# EAGLE design Version2 (EAGLE 7.1.0)
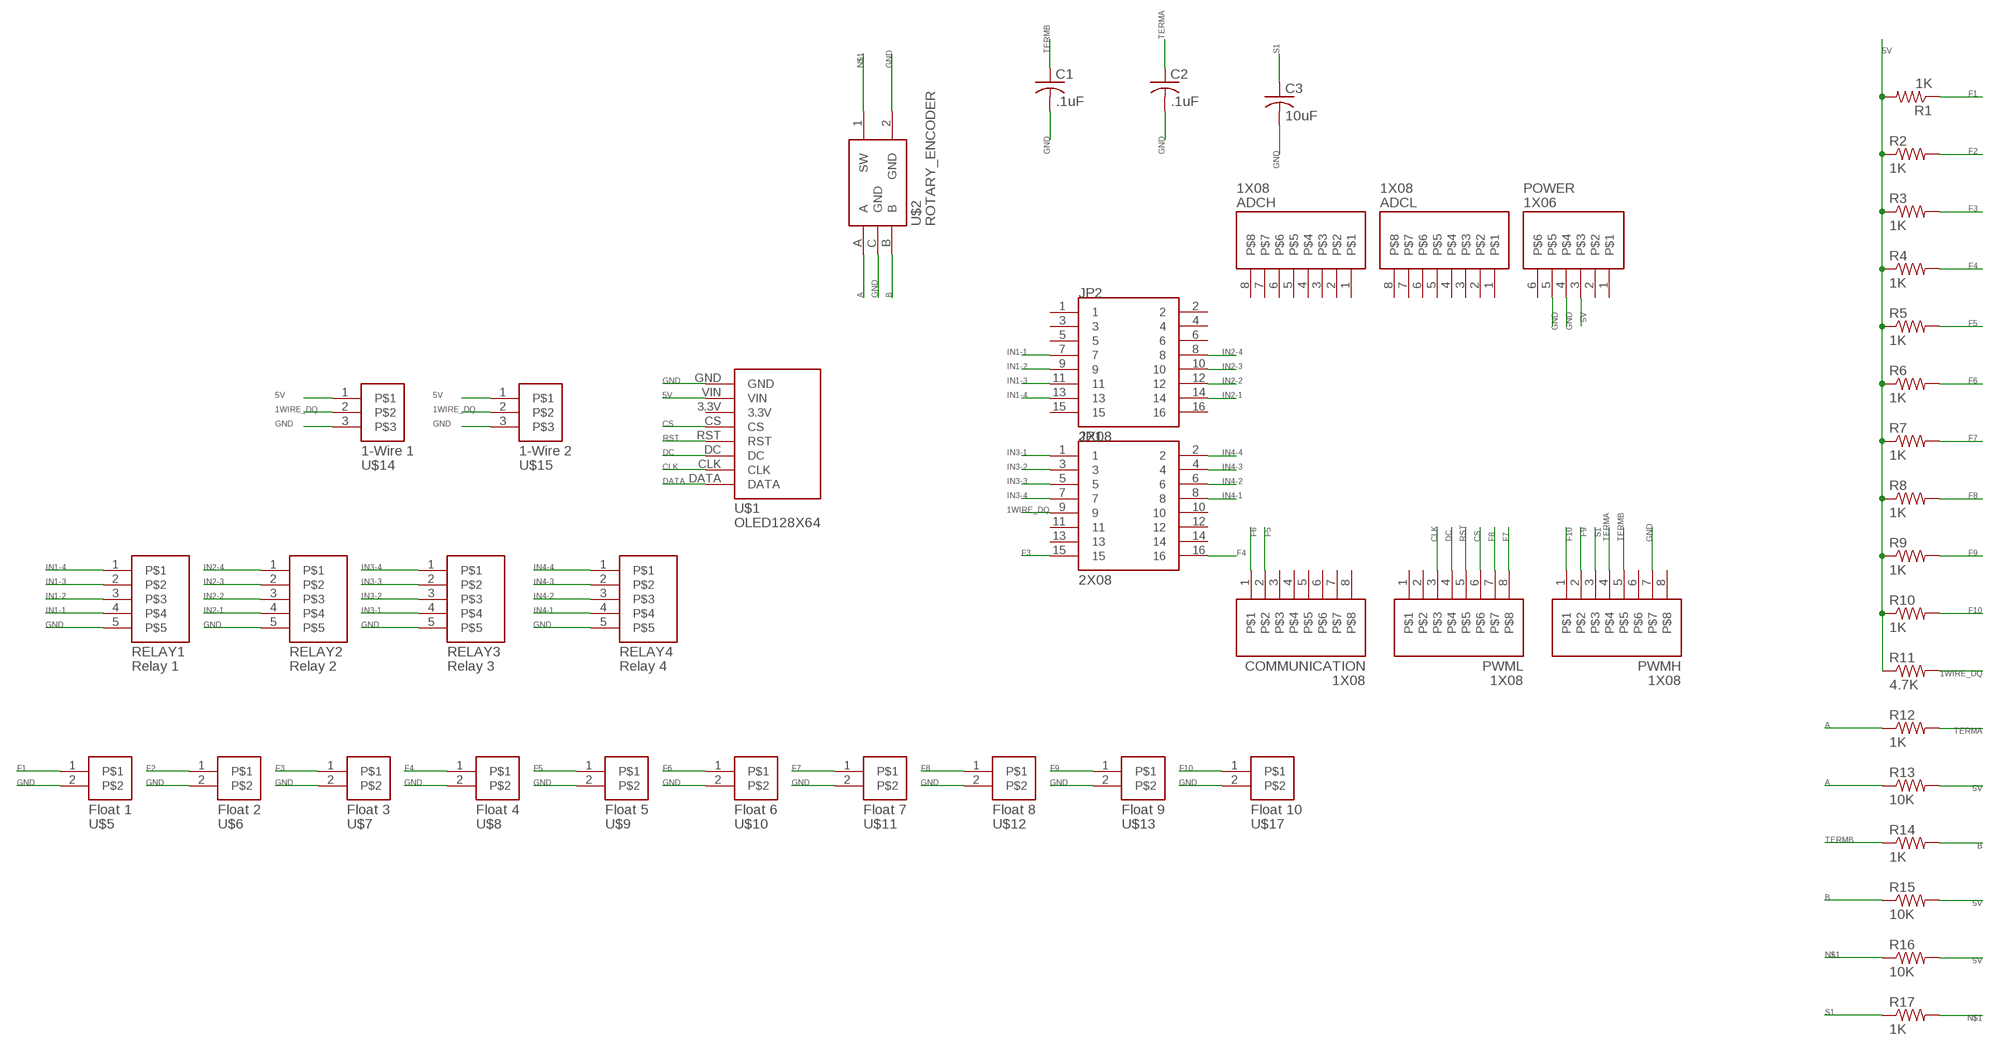
[diagram p0: schematic, sheet 1]

## Parts
ADCH  1X08  [1X08_SMT]
ADCL  1X08  [1X08_SMT]
C1  .1uF  C-USC0805K  [C0805K]
C2  .1uF  C-USC0805K  [C0805K]
C3  10uF  C-USC0805K  [C0805K]
COMMUNICATION  1X08  [1X08_SMT]
JP1  2X08  [2X08_SMT]
JP2  2X08  [2X08_SMT]
POWER  1X06  [1X06_SMT]
PWMH  1X08  [1X08_SMT]
PWML  1X08  [1X08_SMT]
R1  1K  R-US_R0805  [R0805]
R2  1K  R-US_R0805  [R0805]
R3  1K  R-US_R0805  [R0805]
R4  1K  R-US_R0805  [R0805]
R5  1K  R-US_R0805  [R0805]
R6  1K  R-US_R0805  [R0805]
R7  1K  R-US_R0805  [R0805]
R8  1K  R-US_R0805  [R0805]
R9  1K  R-US_R0805  [R0805]
R10  1K  R-US_R0805  [R0805]
R11  4.7K  R-US_R0805  [R0805]
R12  1K  R-US_R0805  [R0805]
R13  10K  R-US_R0805  [R0805]
R14  1K  R-US_R0805  [R0805]
R15  10K  R-US_R0805  [R0805]
R16  10K  R-US_R0805  [R0805]
R17  1K  R-US_R0805  [R0805]
RELAY1  Relay 1  5PIN  [5PIN-MOLEX-HEADER-W-PEGS]
RELAY2  Relay 2  5PIN  [5PIN-MOLEX-HEADER-W-PEGS]
RELAY3  Relay 3  5PIN  [5PIN-MOLEX-HEADER-W-PEGS]
RELAY4  Relay 4  5PIN  [5PIN-MOLEX-HEADER-W-PEGS]
U$1  OLED128X64  [OLED128X64]
U$2  ROTARY_ENCODER  PEC11-4215F-S24  [PEC11-4215F-S24]
U$5  Float 1  2PIN  [2PIN-MOLEX-HEADER-W-PEGS]
U$6  Float 2  2PIN  [2PIN-MOLEX-HEADER-W-PEGS]
U$7  Float 3  2PIN  [2PIN-MOLEX-HEADER-W-PEGS]
U$8  Float 4  2PIN  [2PIN-MOLEX-HEADER-W-PEGS]
U$9  Float 5  2PIN  [2PIN-MOLEX-HEADER-W-PEGS]
U$10  Float 6  2PIN  [2PIN-MOLEX-HEADER-W-PEGS]
U$11  Float 7  2PIN  [2PIN-MOLEX-HEADER-W-PEGS]
U$12  Float 8  2PIN  [2PIN-MOLEX-HEADER-W-PEGS]
U$13  Float 9  2PIN  [2PIN-MOLEX-HEADER-W-PEGS]
U$14  1-Wire 1  3PIN  [3PIN-MOLEX-HEADER-W-PEGS]
U$15  1-Wire 2  3PIN  [3PIN-MOLEX-HEADER-W-PEGS]
U$17  Float 10  2PIN  [2PIN-MOLEX-HEADER-W-PEGS]

## Nets
1WIRE_DQ: JP1.9 R11.2 U$14.2 U$15.2
5V: POWER.3 R1.2 R2.1 R3.1 R4.1 R5.1 R6.1 R7.1 R8.1 R9.1 R10.1 R11.1 R13.2 R15.2 R16.2 U$1.VIN U$14.1 U$15.1
A: R12.1 R13.1 U$2.A
B: R14.2 R15.1 U$2.B
CLK: PWML.3 U$1.CLK
CS: PWML.6 U$1.CS
DATA: U$1.DATA
DC: PWML.4 U$1.DC
F1: R1.1 U$5.1
F2: R2.2 U$6.1
F3: JP1.15 R3.2 U$7.1
F4: JP1.16 R4.2 U$8.1
F5: COMMUNICATION.2 R5.2 U$9.1
F6: COMMUNICATION.1 R6.2 U$10.1
F7: PWML.8 R7.2 U$11.1
F8: PWML.7 R8.2 U$12.1
F9: PWMH.2 R9.2 U$13.1
F10: PWMH.1 R10.2 U$17.1
GND [gnd]: C1.2 C2.2 C3.2 POWER.4 POWER.5 PWMH.7 RELAY1.5 RELAY2.5 RELAY3.5 RELAY4.5 U$1.GND U$2.2(GND) U$2.C(GND) U$5.2 U$6.2 U$7.2 U$8.2 U$9.2 U$10.2 U$11.2 U$12.2 U$13.2 U$14.3 U$15.3 U$17.2
IN1-1: JP2.7 RELAY1.4
IN1-2: JP2.9 RELAY1.3
IN1-3: JP2.11 RELAY1.2
IN1-4: JP2.13 RELAY1.1
IN2-1: JP2.14 RELAY2.4
IN2-2: JP2.12 RELAY2.3
IN2-3: JP2.10 RELAY2.2
IN2-4: JP2.8 RELAY2.1
IN3-1: JP1.1 RELAY3.4
IN3-2: JP1.3 RELAY3.3
IN3-3: JP1.5 RELAY3.2
IN3-4: JP1.7 RELAY3.1
IN4-1: JP1.8 RELAY4.4
IN4-2: JP1.6 RELAY4.3
IN4-3: JP1.4 RELAY4.2
IN4-4: JP1.2 RELAY4.1
N$1: R16.1 R17.2 U$2.1(SW)
RST: PWML.5 U$1.RST
S1: C3.1 PWMH.3 R17.1
TERMA: C2.1 PWMH.4 R12.2
TERMB: C1.1 PWMH.5 R14.1
Unconnected: ADCH.1 ADCH.2 ADCH.3 ADCH.4 ADCH.5 ADCH.6 ADCH.7 ADCH.8 ADCL.1 ADCL.2 ADCL.3 ADCL.4 ADCL.5 ADCL.6 ADCL.7 ADCL.8 COMMUNICATION.3 COMMUNICATION.4 COMMUNICATION.5 COMMUNICATION.6 COMMUNICATION.7 COMMUNICATION.8 JP1.10 JP1.11 JP1.12 JP1.13 JP1.14 JP2.1 JP2.2 JP2.3 JP2.4 JP2.5 JP2.6 JP2.15 JP2.16 POWER.1 POWER.2 POWER.6 PWMH.6 PWMH.8 PWML.1 PWML.2 U$1.3.3V

## Library data of the parts
ADCH ADCL COMMUNICATION PWMH PWML = pinhead:1X08
C1 = rcl:C-US: CAPACITOR, American symbol
C2 C3 = resistor:C-US: CAPACITOR, American symbol
JP1 JP2 = pinhead:2X08
POWER = pinhead:1X06
R1-R17 = rcl:R-US_: RESISTOR, American symbol
RELAY1-RELAY4 = Saleem_lib:5PIN
U$1 = Saleem_lib:OLED128X64
U$2 = Saleem_lib:PEC11-4215F-S24
U$5-U$13 U$17 = Saleem_lib:2PIN
U$14 U$15 = Saleem_lib:3PIN

## Net classes
0 default: width 0.203 mm, drill 0.406 mm, clearance 0.203 mm
2 gnd: width 0.305 mm, drill 0.711 mm, clearance 0.203 mm

## Board
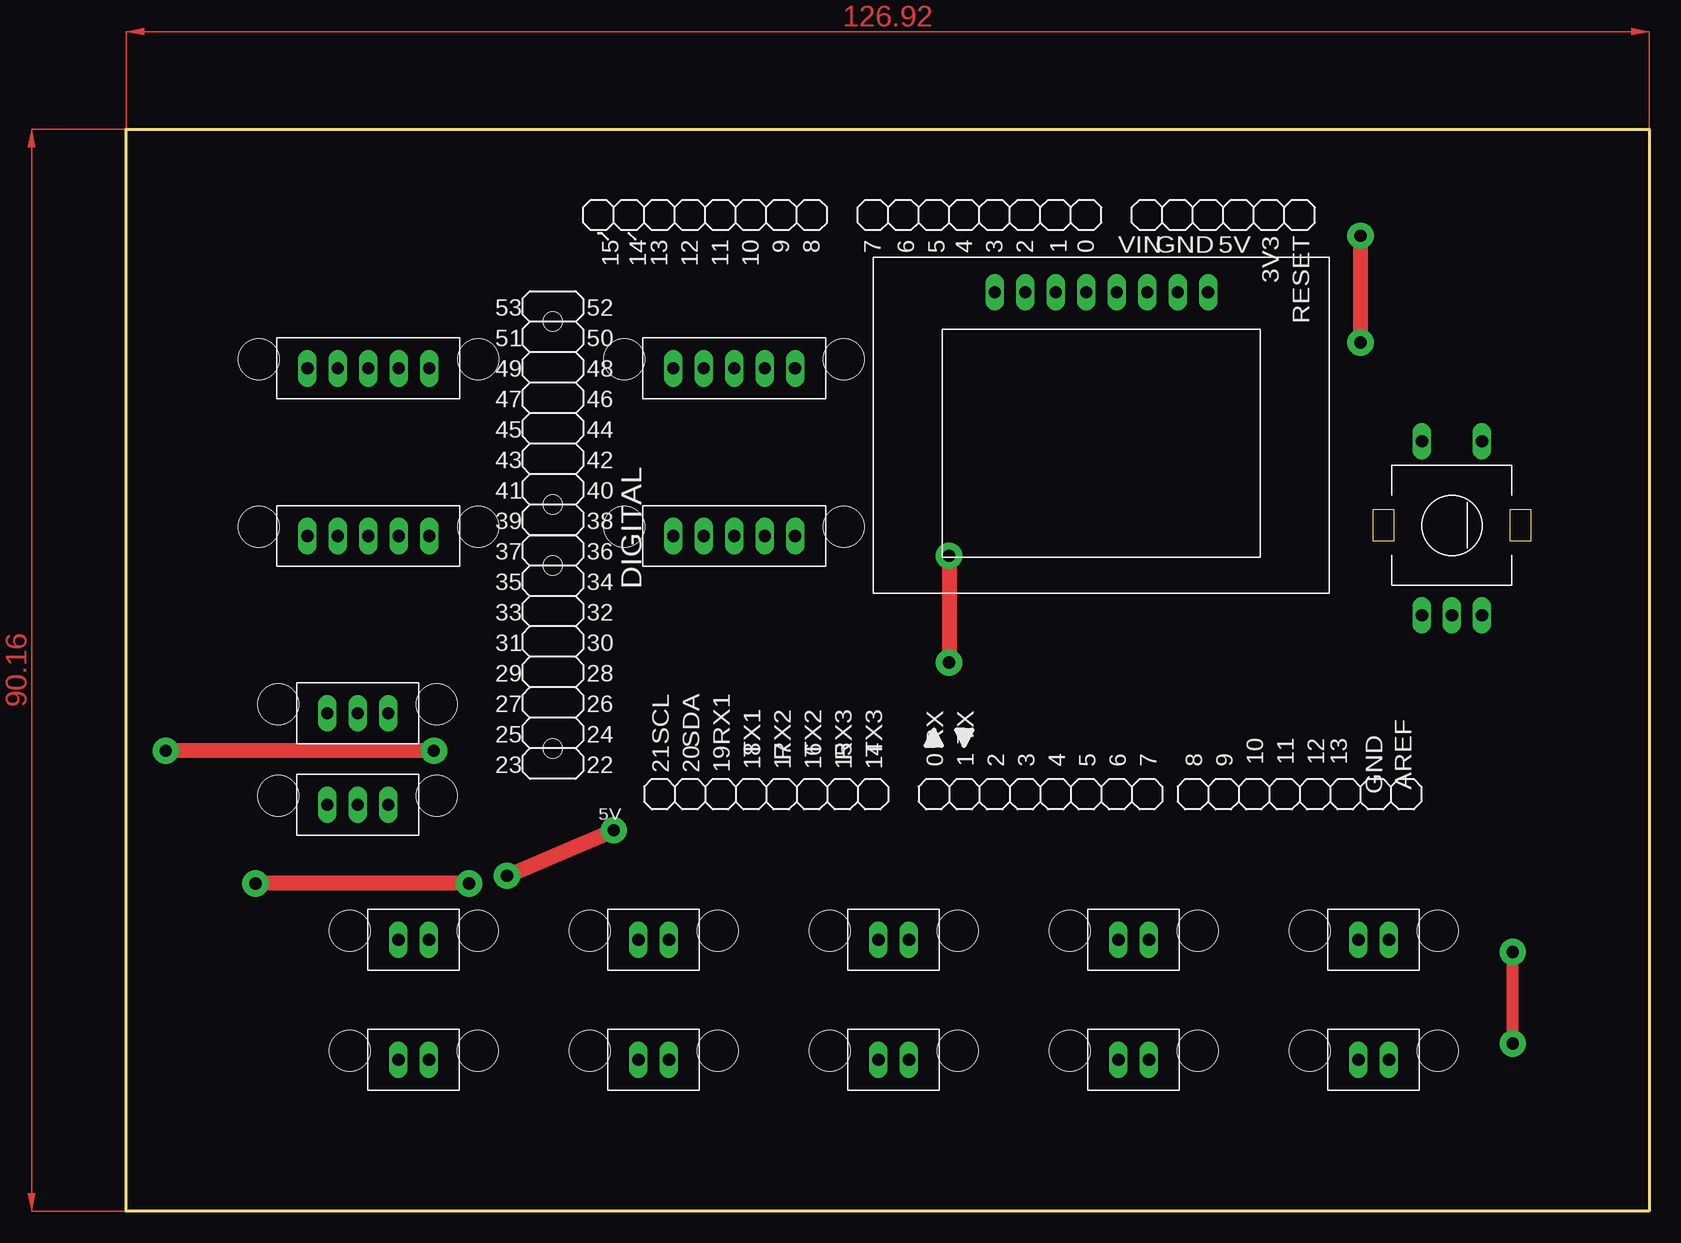
[diagram p1: board, top side]
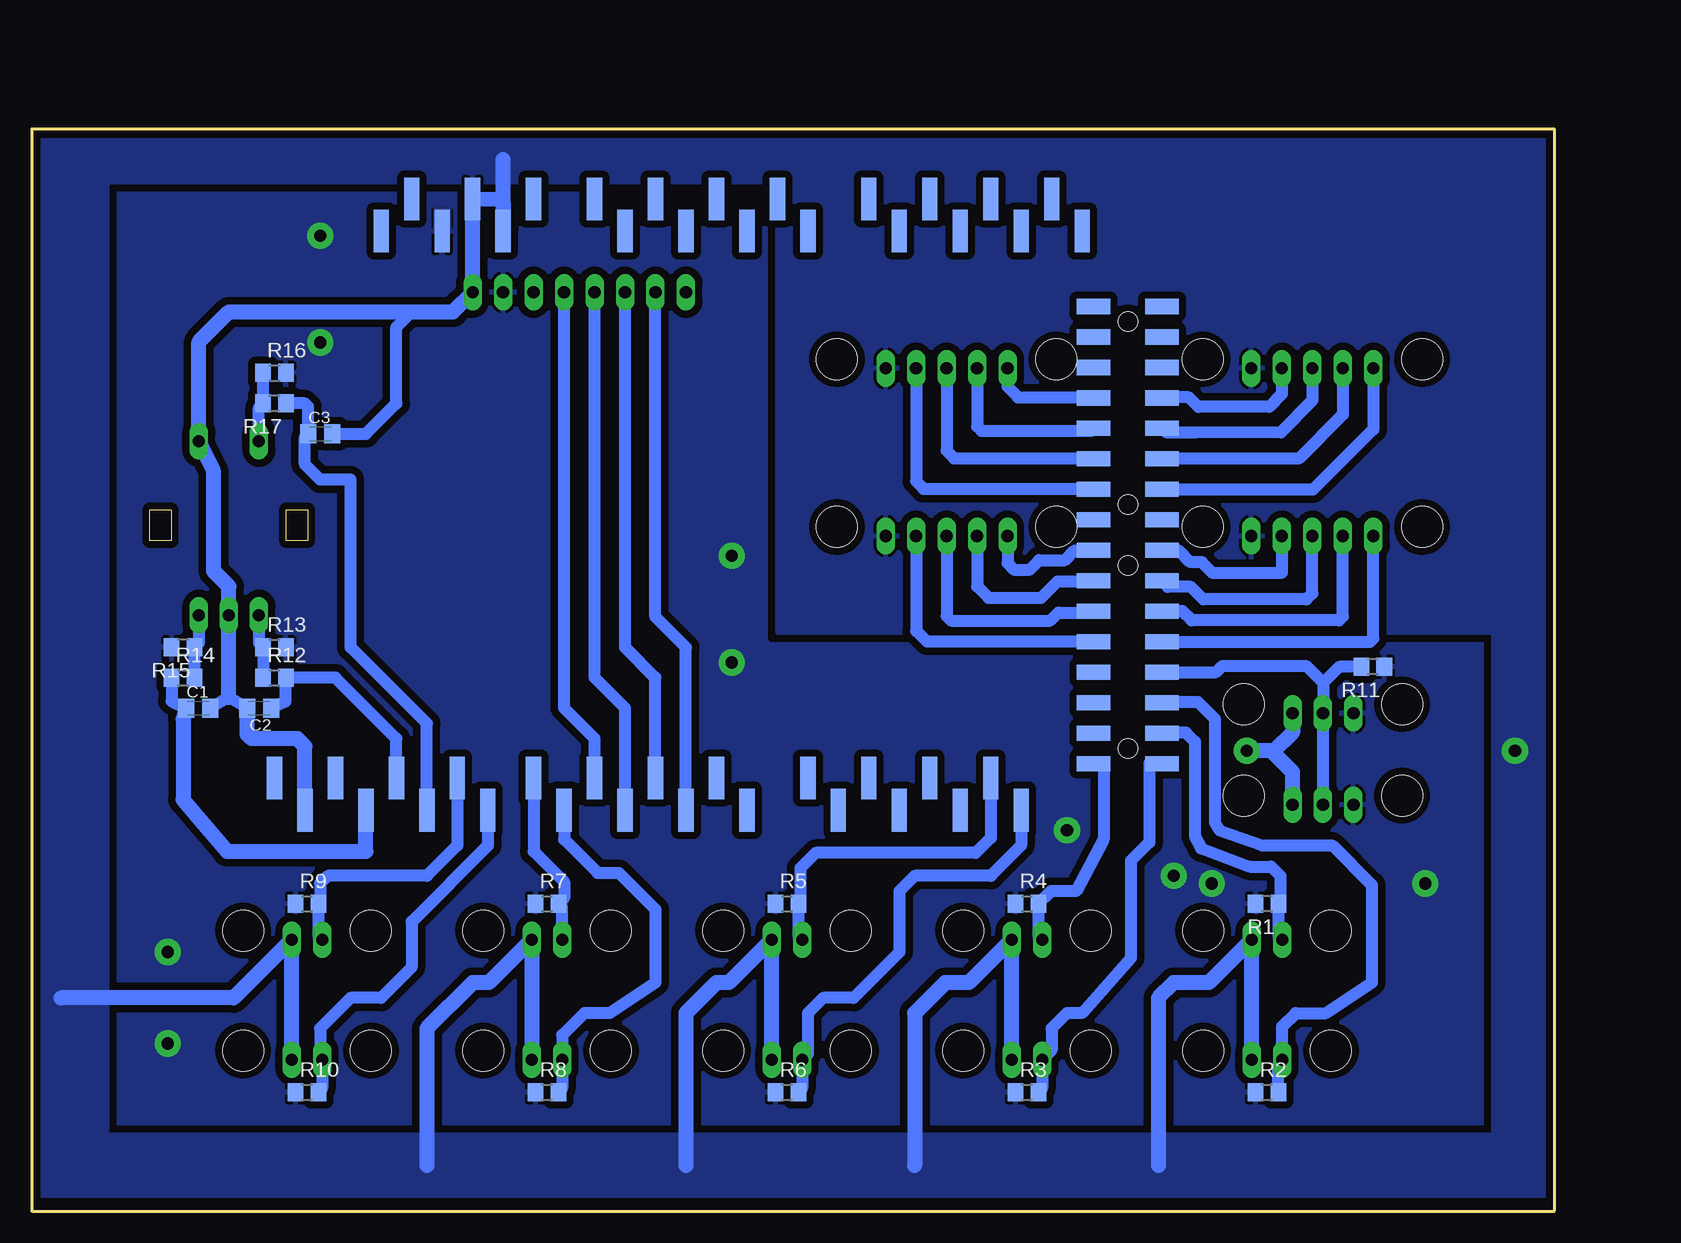
[diagram p2: board, bottom side, seen from below]

Size 126.92 x 90.16 mm. Coordinates in mm from the lower left corner, seen from the top.
Outline: 0,90.16 126.92,90.16 126.92,0 0,0 0,90.16
Copper layers (1*16): Top 0.0356mm / dielectric 1.5011mm / Bottom 0.0356mm
Design rules "default": minimum track width 6mil, minimum drill 13mil, track to track 6mil, track to pad 6mil, pad to pad 6mil, via to via 6mil, smd to smd 6mil, copper to edge 15mil, drill to drill 6mil, minimum pad ring 7mil, minimum via ring 7mil, stop-mask expansion 0mil, vias tented up to drill 24mil, thermal gap 10mil

### Footprints (pad centres in the part's own frame; a part is rotated, then mirrored left to right if it is on the bottom)
1X08_SMT = smd 1.27 x 3.56 bottom: 1 -8.89,-1.335; 2 -6.35,1.335; 3 -3.81,-1.335; 4 -1.27,1.335; 5 1.27,-1.335; 6 3.81,1.335; 7 6.35,-1.335; 8 8.89,1.335
C0805K = smd 1.3 x 1.6: 1 -1,0; 2 1,0
2X08_SMT = smd 1.27 x 2.79 bottom: 1 -7.62,-2.855; 2 -7.62,2.855; 3 -5.08,-2.855; 4 -5.08,2.855; 5 -2.54,-2.855; 6 -2.54,2.855; 7 0,-2.855; 8 0,2.855; 9 2.54,-2.855; 10 2.54,2.855; 11 5.08,-2.855; 12 5.08,2.855; 13 7.62,-2.855; 14 7.62,2.855; 15 10.16,-2.855; 16 10.16,2.855 | hole 1.6: -6.35,0; 8.89,0
1X06_SMT = smd 1.27 x 3.56 bottom: 1 -6.35,1.335; 2 -3.81,-1.335; 3 -1.27,1.335; 4 1.27,-1.335; 5 3.81,1.335; 6 6.35,-1.335
R0805 = smd 1.3 x 1.5: 1 -0.95,0; 2 0.95,0
5PIN-MOLEX-HEADER-W-PEGS = drill 1.016 long: 1 -5.08,0; 2 -2.54,0; 3 0,0; 4 2.54,0; 5 5.08,0 | hole 3.4: -9.14,0.76; 9.14,0.76
OLED128X64 = drill 1.016 long: 3.3V 3.81,11.08; CLK -6.35,11.08; CS 1.27,11.08; DATA -8.89,11.08; DC -3.81,11.08; GND 8.89,11.08; RST -1.27,11.08; VIN 6.35,11.08
PEC11-4215F-S24 = drill 1.016 long: 1 -2.5,7; 2 2.5,7; A -2.5,-7.5; B 2.5,-7.5; C 0,-7.5
2PIN-MOLEX-HEADER-W-PEGS = drill 1.016 long: 1 -1.27,0; 2 1.27,0 | hole 3.4: -5.33,0.76; 5.33,0.76
3PIN-MOLEX-HEADER-W-PEGS = drill 1.016 long: 1 -2.54,0; 2 0,0; 3 2.54,0 | hole 3.4: -6.6,0.76; 6.6,0.76

### Placement (x,y rotation side)
ADCH  48.26,83.01 180 top
ADCL  71.12,83.01 180 top
C1  113.03,41.91 0 bottom
C2  107.95,41.91 180 bottom
C3  102.87,64.77 0 bottom
COMMUNICATION  53.34,34.75 0 top
JP1  35.56,47.45 270 top
JP2  35.56,67.77 270 top
POWER  91.44,83.01 180 top
PWMH  97.79,34.75 0 top
PWML  76.2,34.75 0 top
R1  23.97,25.62 180 bottom
R2  23.97,9.91 0 bottom
R3  43.97,9.91 0 bottom
R4  43.97,25.62 0 bottom
R5  63.97,25.62 0 bottom
R6  63.97,9.91 0 bottom
R7  83.97,25.62 0 bottom
R8  83.97,9.91 0 bottom
R9  103.97,25.62 0 bottom
R10  103.97,9.91 0 bottom
R11  15.15,45.36 180 bottom
R12  106.68,44.45 0 bottom
R13  106.68,46.99 0 bottom
R14  114.3,44.45 0 bottom
R15  114.3,46.99 180 bottom
R16  106.68,69.85 0 bottom
R17  106.68,67.31 180 bottom
RELAY1  20.19,70.23 0 top
RELAY2  50.67,70.23 0 top
RELAY3  20.19,56.26 0 top
RELAY4  50.67,56.26 0 top
U$1  81.28,65.48 0 top
U$2  110.49,57.15 0 top
U$5  23.97,22.62 0 top
U$6  23.97,12.62 0 top
U$7  43.97,12.62 0 top
U$8  43.97,22.62 0 top
U$9  63.97,22.62 0 top
U$10  63.97,12.62 0 top
U$11  83.97,22.62 0 top
U$12  83.97,12.62 0 top
U$13  103.97,22.62 0 top
U$14  19.3,41.48 0 top
U$15  19.3,33.86 0 top
U$17  103.97,12.62 0 top

### Tracks (layer width: path | path; a pad name or v marks a point on that pad's centre or on a via)
1WIRE_DQ
  Bottom 1.016: 19.24,41.55 U$14.2 | U$14.2 U$15.2 | JP1.9 28.2,44.91 27.68,45.43 20.71,45.43 19.29,44.02 | 19.29,44.02 19.29,41.49 U$14.2 | R11.2 17.96,45.36 19.29,44.02
5V  (via drill 1.02 pad 2.18)
  Top 1.016: v115.57,13.97 v115.57,21.59
  Top 1.27: v28.58,27.3 v10.8,27.3 | v68.58,54.61 v68.58,45.72 | v31.75,27.94 v40.64,31.75 | v102.87,81.28 v102.87,72.39
  pour Bottom (isolate 0.61, rank 2): -1.27,91.44 127.64,91.44 127.64,-0.64 -1.27,-0.64
  pour Bottom (no thermals): 92.08,83.82 92.08,81.92 93.34,81.92 93.34,83.82
A
  Bottom 1.016: U$2.A 107.99,47.35 R13.1 R12.1
B
  Bottom 1.016: U$2.B 112.99,47.35 R15.1 R14.2
CLK
  Bottom 1.016: PWML.3 72.39,46.99 74.93,49.53 U$1.CLK
CS
  Bottom 1.016: PWML.6 80.01,39.37 82.55,41.91 U$1.CS
DC
  Bottom 1.016: PWML.4 74.93,44.45 77.47,46.99 U$1.DC
F1
  Bottom 1.016: U$5.1 23.02,22.94 R1.1 22.86,25.78 22.86,27.94 23.62,28.7 25.4,28.7 29.46,30.23 29.97,31.24 29.97,39.12 30.73,39.88 32.77,39.88
F2
  Bottom 1.016: 28.32,41.02 28.32,32.38 27.94,31.75 24.38,30.48 18.54,30.48 15.24,27.18 15.24,19.05 19.05,16.51 21.59,16.51 22.7,15.4 U$6.1 23.02,12.3 R2.2
F3
  Bottom 1.016: JP1.15 32.75,37.34 33.78,37.34 33.78,30.73 35.31,29.21 35.31,21.08 39.37,16.51 40.64,16.51 41.91,15.24 41.91,13.41 U$7.1 42.7,10.22 R3.2
F4
  Bottom 1.016: JP1.16 38.37,37.34 37.85,37.34 37.59,37.08 37.59,30.99 39.88,26.67 41.97,26.67 R4.2 43.02,22.94 U$8.1
F5
  Bottom 1.016: COMMUNICATION.2 46.99,31.12 48.26,29.85 61.59,29.85 62.87,28.57 62.87,25.78 R5.2 63.02,22.94 U$9.1
F6
  Bottom 1.016: COMMUNICATION.1 44.45,30.48 46.99,27.94 53.34,27.94 54.61,26.67 54.61,21.59 58.42,17.78 60.96,17.78 62.23,16.51 62.23,13.09 U$10.1 62.7,10.22 R6.2
F7
  Bottom 1.016: PWML.8 85.09,29.97 82.55,27.43 82.55,26.09 R7.2 82.7,25.3 U$11.1
F8
  Bottom 1.016: PWML.7 82.55,30.99 79.76,28.19 77.98,28.19 74.93,25.15 74.93,19.05 78.74,16.51 80.86,16.51 82.7,14.67 U$12.1 82.7,10.22 R8.2
F9
  Bottom 1.016: PWMH.2 91.44,30.48 93.98,27.94 102.23,27.94 102.87,27.3 102.87,25.77 R9.2 103.02,22.94 U$13.1
F10
  Bottom 1.016: PWMH.1 88.9,30.48 95.25,24.13 95.25,20.32 97.79,17.78 100.33,17.78 102.87,15.24 102.87,12.79 U$17.1 102.7,10.22 R10.2
GND  (via drill 1.02 pad 2.18)
  Top 1.27: 25.4,38.61 v25.65,38.35 v3.3,38.35
  Bottom 1.016: C2.2 110.49,42.81 C1.2 | C3.2 99.06,64.77 96.52,67.31 96.52,73.66 95.25,74.93
  Bottom 1.27: 124.46,17.78 110.08,17.78 U$13.2 U$17.2 | U$12.2 U$11.2 88.81,19.05 90.17,19.05 93.98,15.24 93.98,3.81 | 72.39,3.81 72.39,16.51 69.85,19.05 68.81,19.05 U$9.2 U$10.2 | 53.34,3.81 53.34,16.51 50.8,19.05 48.81,19.05 U$8.2 U$7.2 | 33.02,3.81 33.02,17.78 31.75,19.05 28.81,19.05 U$5.2 U$6.2 | PWMH.7 104.14,38.73 104.78,39.37 108.58,39.37 108.95,39.73 C2.2 | 110.49,42.81 U$2.C 110.49,52.07 111.76,53.34 111.76,61.65 U$2.2 112.99,72.43 110.49,74.93 95.25,74.93 91.8,74.93 U$1.GND POWER.4 87.88,84.33 87.63,84.07 POWER.5 87.63,87.63 | U$15.3 21.84,36.58 23.62,38.35 v25.65,38.35 23.37,38.35 21.84,39.88 U$14.3
  pour Bottom (isolate 0.61): 5.08,85.73 120.65,85.73 120.65,6.35 5.08,6.35 5.08,85.09 0.63,85.09 0.63,1.27 127,1.27 127,89.54 4.45,89.54
  pour Bottom (isolate 0.61): 0.63,90.17 64.77,90.17 64.77,48.26 0.63,48.26
IN1-1
  Bottom 1.016: RELAY1.4 22.73,68.1 23.8,67.03 29.69,67.03 30.48,67.82 32.66,67.82 JP2.7
IN1-2
  Bottom 1.016: RELAY1.3 20.19,67.59 22.81,64.9 29.92,64.87 32.35,64.87 JP2.9
IN1-3
  Bottom 1.016: RELAY1.2 17.65,66.4 21.34,62.71 32.68,62.71 JP2.11
IN1-4
  Bottom 1.016: RELAY1.1 15.11,65.15 20.14,60.12 32.68,60.12 JP2.13
IN2-1
  Bottom 1.016: RELAY2.4 53.21,60.83 52.58,60.2 38.46,60.2 JP2.14
IN2-2
  Bottom 1.016: RELAY2.3 50.67,63.37 50.04,62.74 38.46,62.74 JP2.12
IN2-3
  Bottom 1.016: RELAY2.2 48.13,65.41 47.75,65.02 38.62,65.02 JP2.10
IN2-4
  Bottom 1.016: RELAY2.1 45.59,68.71 44.7,67.82 38.46,67.82 JP2.8
IN3-1
  Bottom 1.016: RELAY3.4 22.73,53.24 22.81,53.16 28.47,53.16 29.39,54.08 30.35,54.08 31.34,55.07 JP1.1
IN3-2
  Bottom 1.016: JP1.3 32.7,52.46 32.25,52.01 30.32,52.01 29.28,50.98 20.69,50.98 20.19,51.47 RELAY3.3
IN3-3
  Bottom 1.016: JP1.5 32.69,50.01 31.03,50.01 30.25,49.23 17.98,49.23 17.65,49.56 RELAY3.2
IN3-4
  Bottom 1.016: JP1.7 32.68,47.42 15.39,47.42 15.11,47.7 RELAY3.1
IN4-1
  Bottom 1.016: RELAY4.4 53.21,48.36 52.32,47.47 38.44,47.47 JP1.8
IN4-2
  Bottom 1.016: RELAY4.3 50.67,49.58 50.29,49.2 42.04,49.2 41.35,49.89 38.52,49.89 JP1.6
IN4-3
  Bottom 1.016: RELAY4.2 48.13,52.07 47.17,51.1 42.8,51.1 41.43,52.48 38.47,52.48 JP1.4
IN4-4
  Bottom 1.016: RELAY4.1 45.59,54 45.06,53.47 43.74,53.47 42.95,54.25 40.79,54.25 39.98,55.07 JP1.2
N$1
  Bottom 1.016: U$2.1 107.99,66.95 R17.2 R16.1
RST
  Bottom 1.016: PWML.5 77.47,41.91 80.01,44.45 U$1.RST
S1
  Bottom 1.016: PWMH.3 93.98,40.64 100.33,46.99 100.33,60.96 102.87,60.96 104.14,62.23 104.14,64.5 C3.1 103.87,67.04 104.14,67.31 R17.1
S$1
  Bottom 1.016: 28.45,41.15 29.72,42.42 32.77,42.42
TERMA
  Bottom 1.016: PWMH.4 96.52,39.37 101.6,44.45 R12.2 105.78,44.4 105.78,42.45 C2.1
TERMB
  Bottom 1.016: R14.1 115.25,42.49 C1.1
  Bottom 1.27: C1.1 114.3,41 114.3,34.29 110.62,29.97 99.06,29.97 PWMH.5
(copper drawn outside any net)
  shapes: Top area x2

### Text on the board
tPlace: 15 | 14 | 13 | 12 | 11 | 10 | 9 | 8 | 7 | 6 | 5 | 4 | 3 | 2 | 1 | 0 | 53 | 52 | 51 | 50 | 49 | 48 | 47 | 46 | 45 | 44 | 43 | 42 | 41 | 40 | 39 | 38 | 37 | 36 | 35 | 34 | 33 | 32 | 31 | 30 | 29 | 28 | 27 | 26 | 25 | 24 | 10 | 11 | 12 | 13 | 21 | 20 | 19 | 18 | 17 | 16 | 15 | 14 | 0 | 1 | 2 | 3 | 4 | 5 | 6 | 7 | 8 | 9 | 23 | 22
tNames: VIN | GND | 5V | 3V3 | RESET | DIGITAL | SCL | SDA | RX1 | TX1 | RX2 | TX2 | RX3 | TX3 | RX | TX | AREF | GND | 5V